# Altium schematic sheet Selfie.SchDoc
size A4
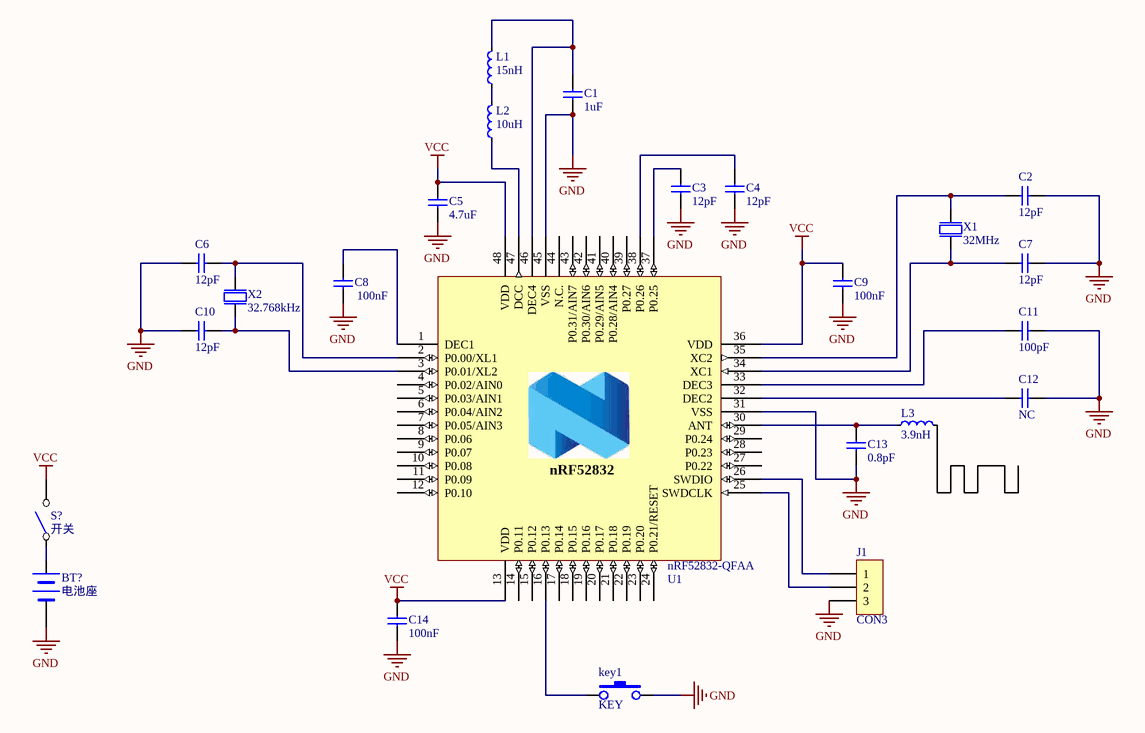
[diagram p0: Selfie.SchDoc]

## Parts
BT?  电池座  [PCBComponent_1]
C1  1uF  [C 0402_L]
C2  12pF  [C 0402_L]
C3  12pF  [C 0402_L]
C4  12pF  [C 0402_L]
C5  4.7uF  [C 0402_L]
C6  12pF  [C 0402_L]
C7  12pF  [C 0402_L]
C8  100nF  [C 0402_L]
C9  100nF  [C 0402_L]
C10  12pF  [C 0402_L]
C11  100pF  [C 0402_L]
C12  NC  [C 0402_L]
C13  0.8pF  [C 0402_L]
C14  100nF  [C 0402_L]
J1  CON3  [ISP4]
key1  KEY  [TSW SMD-12*12*5]
L1  15nH  [R 0402_L]
L2  10uH  [L 0603]
L3  3.9nH  [R 0402_L]
S?  开关  [MSK-12C01-07]
U1  nRF52832-QFAA  [QFN40P600X600X90-48N]
X1  32MHz  [OSC 3225-4P]
X2  32.768kHz  [XTAL_3215]

## Nets
GND: BT?.2(-) C1.1 C2.2 C3.1 C4.1 C5.1 C6.1 C7.2 C8.1 C9.1 C10.1 C11.2 C12.2 C13.1 C14.1 J1.3 key1.2 U1.31(VSS) U1.45(VSS) U1.49(GND) X1.2(GND) X1.4(GND)
VCC: C5.2 C9.2 C14.2 S?.2 U1.13(VDD) U1.36(VDD) U1.48(VDD)
NetBT?_1: BT?.1(+) S?.1
NetC1_2: C1.2 L1.2 U1.46(DEC4)
NetC2_1: C2.1 U1.35(XC2) X1.3(out)
NetC3_2: C3.2 U1.37(P0.25)
NetC4_2: C4.2 U1.38(P0.26)
NetC6_2: C6.2 U1.2(P0.00/XL1) X2.2(out)
NetC7_1: C7.1 U1.34(XC1) X1.1(inp)
NetC8_2: C8.2 U1.1(DEC1)
NetC10_2: C10.2 U1.3(P0.01/XL2) X2.1(inp)
NetC11_1: C11.1 U1.33(DEC3)
NetC12_1: C12.1 U1.32(DEC2)
NetC13_2: C13.2 L3.1 U1.30(ANT)
NetJ1_1: J1.1 U1.26(SWDIO)
NetJ1_2: J1.2 U1.25(SWDCLK)
Netkey1_1: key1.1 U1.16(P0.13)
NetL1_1: L1.1 L2.2
NetL2_1: L2.1 U1.47(DCC)

Not connected (* = marked no-connect by the designer): L3 2; U1 4(P0.02/AIN0) 5(P0.03/AIN1) 6(P0.04/AIN2) 7(P0.05/AIN3) 8(P0.06) 9(P0.07) 10(P0.08) 11(P0.09) 12(P0.10) 14(P0.11) 15(P0.12) 17(P0.14) 18(P0.15) 19(P0.16) 20(P0.17) 21(P0.18) 22(P0.19) 23(P0.20) 24(P0.21/RESET) 27(P0.22) 28(P0.23) 29(P0.24) 39(P0.27) 40(P0.28/AIN4) 41(P0.29/AIN5) 42(P0.30/AIN6) 43(P0.31/AIN7) 44(N.C.)

## Notes on the sheet
- (in symbol nRF52832_QFAA) nRF52832

## Library data of the parts
BT? = 干电池: Battery
C1-C14 = CAP: Capacitor, NP0, ?.1pF; Part Number: C0402-1.2p; Value: 1.2pF; Note: 50V; Artikkelnr Noca: 20029157; Artikkelnr Simpro: N.A.; Manufacturer: *; Manufacturer Part Number: *; Datasheet: *; LatestRevisionDate: 2011-05-11; Pin Count: 2; Publisher: Nordic Semiconductor; Published: 2009-05-08; Supplier: *; Supplier part number: *; 2nd source Supplier: *; 2nd source part number: *; Footprint Doc: 0402
L1-L3 = IND: Inductor, 80mA, ?0%; Part Number: L0603-10?; Manufacturer: Taiyo Yuden; Manufacturer Part Number: LBMF1608T100K; 2nd source part number: 178-6105; Value: 10礖; Note: LBMF1608T100K 10礖 80mA 0603; Artikkelnr Noca: 33029314; Artikkelnr Simpro: N.A.; Datasheet: http://www.yuden.co.jp/ut/product/pdf/elb2_e.pdf; LatestRevisionDate: 2012-09-19; Pin Count: 2; Publisher: Nordic Semiconductor; Published: 2010-02-24; Supplier: Digi-Key; Supplier part number: 587-1714-1-ND; 2nd source Supplier: Farnell; Footprint Doc: 0603
S? = 单刀开关
U1 = nRF52832_QFAA: Multi-protocol Bluetooth Low Energy and 2.4GHz proprietary system-on-chip; Manufacturer: Nordic Semiconductor; Artikkelnr Noca: N.A.; Part Number: nRF52832-QFAA; Manufacturer Part Number: nRF52832-QFAA; Datasheet: *; LatestRevisionDate: 2014-11-26; Pin Count: 48; Publisher: Nordic Semiconductor; Published: 2014-11-26; Value: nRF52832-QFAA; Note: *; Supplier: Nordic Semiconductor; Supplier part number: *; 2nd source Supplier: *; 2nd source part number: *; Footprint Doc: QFN-48; Artikkelnr Simpro: N.A.
X1 = XTAL_4-pin_grounded: XTAL SMD 2016, 32MHz, Cl=8pF, Tol: ?0ppm, Stab: ?0ppm; Part Number: XTAL_SMD2016_32MHz_8pF_Epson; Manufacturer: Epson Toyocom; Manufacturer Part Number: Q22FA12800025; Note: XTAL SMD 32.000MHz; Artikkelnr Noca: N.A.; Datasheet: http://www.epsondevice.com/docs/qd/en/DownloadServlet?id=ID000449; LatestRevisionDate: 2014-11-27; Pin Count: 4; Publisher: Nordic Semiconductor; Published: 2012-03-09; Value: 32MHz; Supplier: Farnell; Supplier part number: 171-2806; 2nd source Supplier: *; 2nd source part number: *; Footprint Doc: XTAL_2016; Artikkelnr Simpro: N.A.
X2 = XTAL_2-pin: EPSON TOYOCOM - FC-135 32.768KHZ ?0PPM,9.0PF - CRYSTAL, SM, WATCH; Part Number: XTAL_FC-135 32.768k; 2nd source part number: 127-8037; Note: XTAL SMD 32.768kHz, 3215; Artikkelnr Noca: 22019091; Artikkelnr Simpro: N.A.; Manufacturer: Epson Toyocom; Manufacturer Part Number: FC-135 32.768KHZ ?0PPM,9.0PF; Datasheet: http://www.farnell.com/datasheets/57480.pdf; LatestRevisionDate: 2014-03-27; Pin Count: 2; Publisher: Nordic Semiconductor; Published: 2010-10-18; Value: 32.768kHz; Supplier: Digi-Key; Supplier part number: FC-135 32.7680KA-AC-ND; 2nd source Supplier: Farnell; Footprint Doc: XTAL_3215